# Altium schematic sheet MD5133-A02-01.SchDoc
size B; SheetNumber: 0; SheetTotal: 0
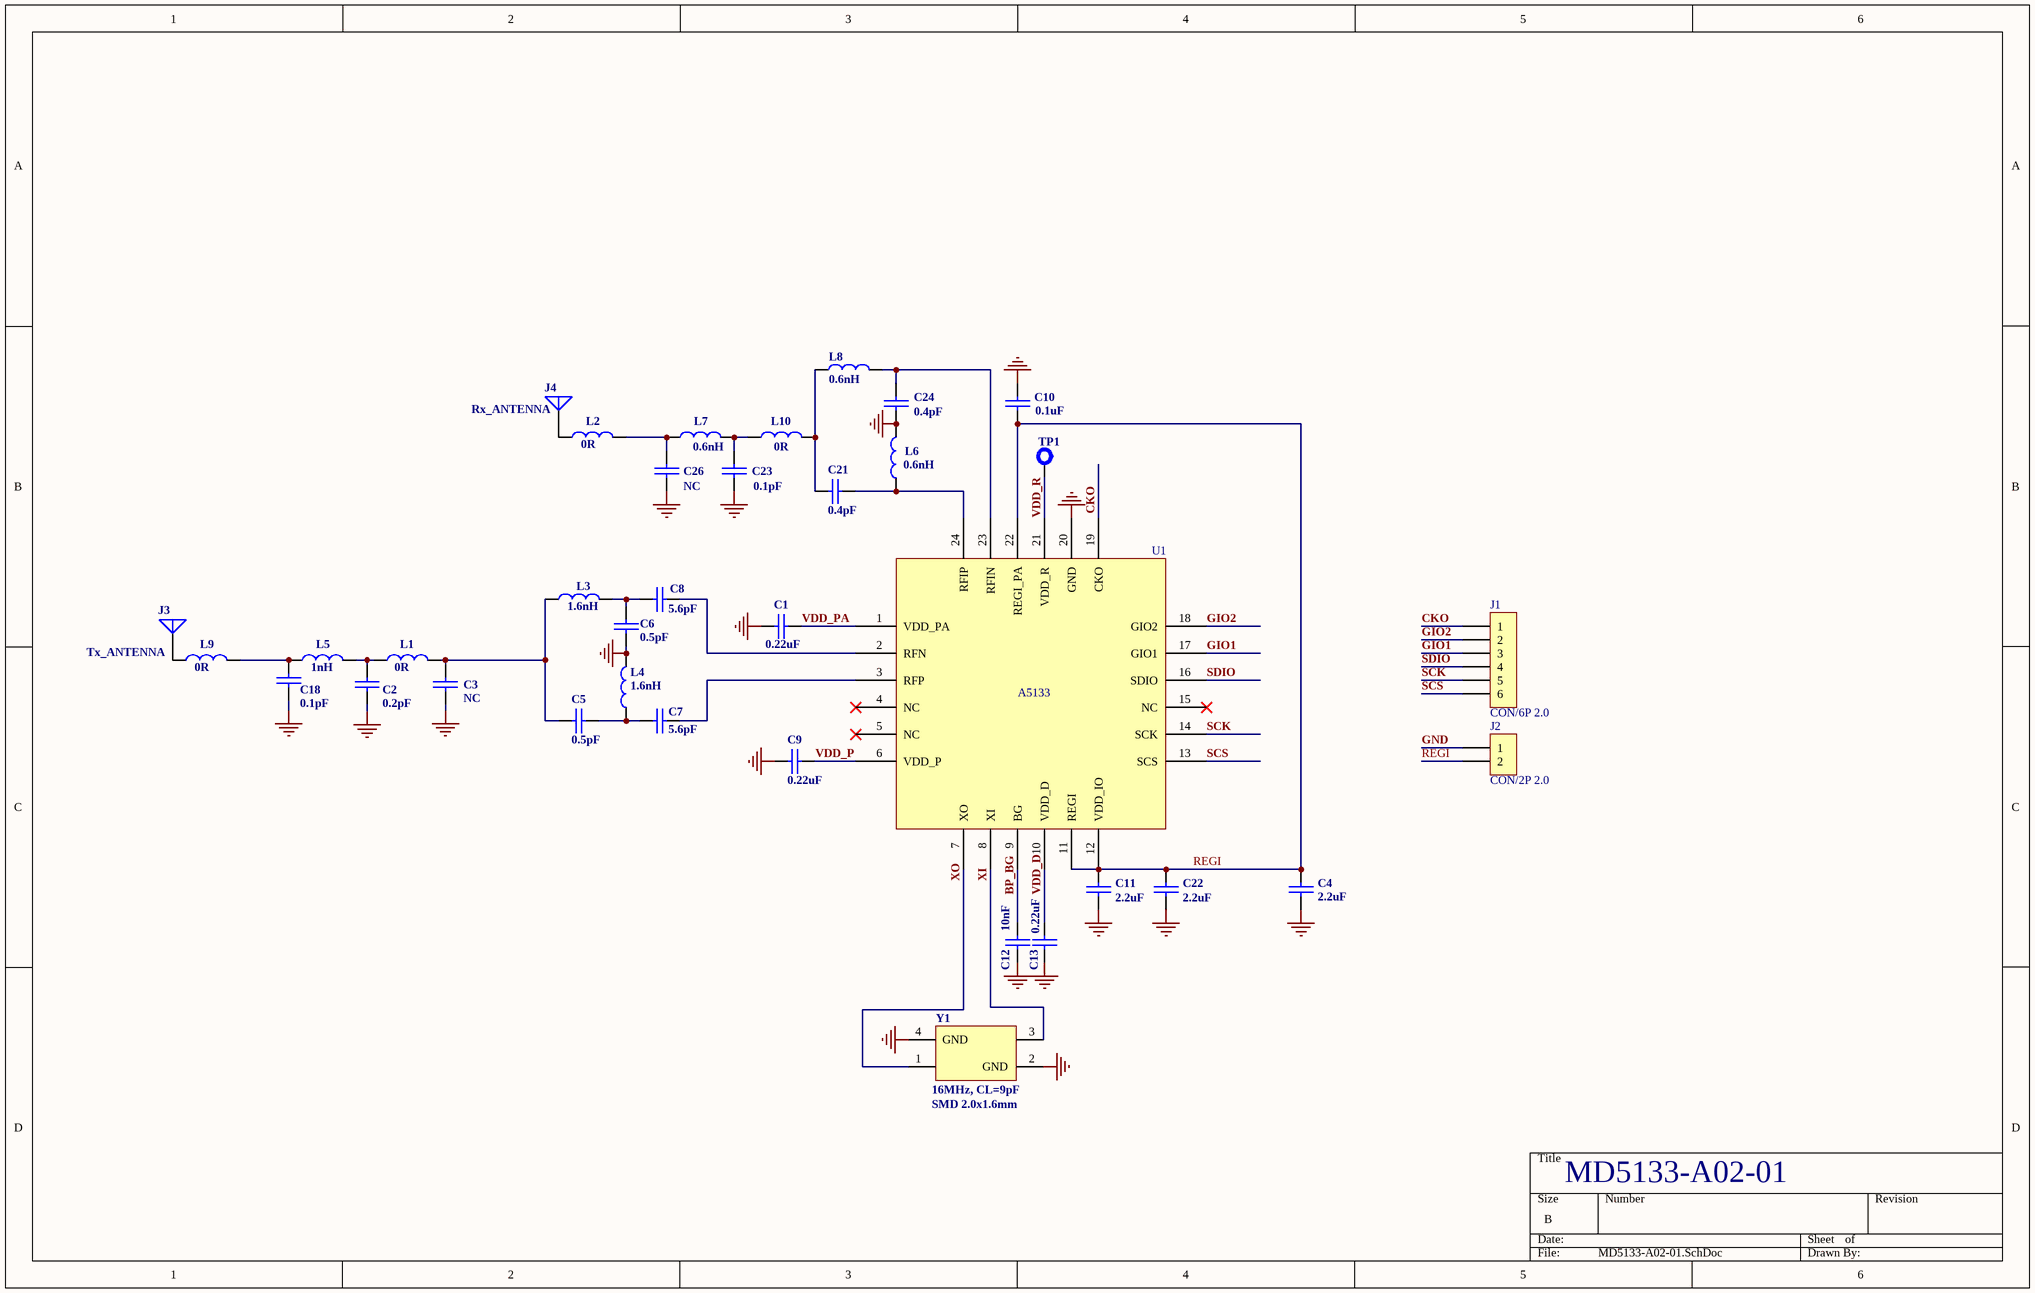
[diagram p0: MD5133-A02-01.SchDoc]

## Parts
C1  0.22uF  [0402]
C2  0.2pF  [0402-3]
C3  NC  [0402-3]
C4  2.2uF  [0402]
C5  0.5pF  [0402-3]
C6  0.5pF  [0402-3]
C7  5.6pF  [0402-3]
C8  5.6pF  [0402-3]
C9  0.22uF  [0402]
C10  0.1uF  [0402]
C11  2.2uF  [0402]
C12  10nF  [0402]
C13  0.22uF  [0402]
C18  0.1pF  [0402-3]
C21  0.4pF  [0402-3]
C22  2.2uF  [0402]
C23  0.1pF  [0402-3]
C24  0.4pF  [0402-3]
C26  NC  [0402-3]
J1  CON/6P 2.0  [HDR6_2.0]
J2  CON/2P 2.0  [HDR2_2.0]
J3  Tx_ANTENNA  [ANT3_5.8G-A1011]
J4  Rx_ANTENNA  [ANT3_5.8G-A1011]
L1  0R  [0402-3]
L2  0R  [0402-3]
L3  1.6nH  [0402-3]
L4  1.6nH  [0402-3]
L5  1nH  [0402-3]
L6  0.6nH  [0402-3]
L7  0.6nH  [0402-3]
L8  0.6nH  [0402-3]
L9  0R  [0402-3]
L10  0R  [0402-3]
TP1  TP  [PAD - SMD]  (value not drawn)
U1  A5133_U02_Q4P24  [QFN 4*4 24L_A7190]  (value not drawn)
Y1  16MHz, CL=9pF  [XTAL_2.0 *1.6]

## Nets
GND: C1.1 C2.2 C3.2 C4.1 C6.2 C9.2 C10.2 C11.1 C12.1 C13.1 C18.2 C22.1 C23.1 C24.1 C26.1 J2.1 L4.2 L6.1 U1.20(GND) Y1.2(GND) Y1.4(GND)
BP_BG: C12.2 U1.9(BG)
CKO: J1.1 U1.19(CKO)
GIO1: J1.3 U1.17(GIO1)
GIO2: J1.2 U1.18(GIO2)
REGI: C4.2 C10.1 C11.2 C22.2 J2.2 U1.11(REGI) U1.12(VDD_IO) U1.22(REGI_PA)
SCK: J1.5 U1.14(SCK)
SCS: J1.6 U1.13(SCS)
SDIO: J1.4 U1.16(SDIO)
VDD_D: C13.2 U1.10(VDD_D)
VDD_P: C9.1 U1.6(VDD_P)
VDD_PA: C1.2 U1.1(VDD_PA)
VDD_R: TP1.1 U1.21(VDD_R)
XI: U1.8(XI) Y1.3
XO: U1.7(XO) Y1.1
NetC2_1: C2.1 L1.1 L5.1
NetC3_1: C3.1 C5.2 L1.2 L3.1
NetC5_1: C5.1 C7.1 L4.1
NetC6_1: C6.1 C8.1 L3.2
NetC7_2: C7.2 U1.3(RFP)
NetC8_2: C8.2 U1.2(RFN)
NetC18_1: C18.1 L5.2 L9.1
NetC21_1: C21.1 L6.2 U1.24(RFIP)
NetC21_2: C21.2 L8.2 L10.1
NetC23_2: C23.2 L7.1 L10.2
NetC24_2: C24.2 L8.1 U1.23(RFIN)
NetC26_2: C26.2 L2.1 L7.2
NetJ3_1: J3.1(A) L9.2
NetJ4_1: J4.1(A) L2.2

Not connected (* = marked no-connect by the designer): U1 4(NC)* 5(NC)* 15(NC)*

## Notes on the sheet
- (near Y1) SMD 2.0x1.6mm
- MD5133-A02-01
- (in symbol A5133_U02_Q4P24) A5133

## Library data of the parts
C1 C4 C9 C11-C13 C22 = CAP
C2 C3 C5-C8 C10 C18 C21 C23 C24 C26 = C/0603: Chip C
J1 = CON/6P 2.0: Hole 36mil
J2 = CON/2P 2.0: Hole 36mil
J3 J4 = ANTENNA
L1-L10 = L/0603
Y1 = CRYSTAL/5*3.2: 12.8MHz , 20P